# Altium schematic sheet Supply 5V.SchDoc: 5V Isolated Supply
size A4; DocumentNumber: 8; SheetNumber: 8; SheetTotal: 9
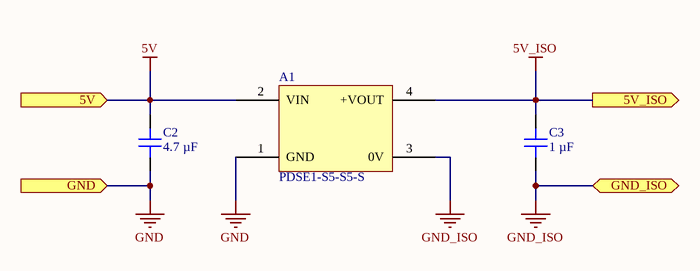
[diagram p0: Supply 5V.SchDoc]

## Parts
A1  PDSE1-S5-S5-S  [CUI PDSE1-S]
C2  4.7 µF  [CAP 0805_2012]
C3  1 µF  [CAP 0805_2012]

## Ports
5V (in, see Review[2C], AC current measurement[1A], Connectors[3A], Opto[1B], SSR_switch[1A], Supply 15V[2B]), 5V_ISO (out, see Review[2C]), GND (in, see Review[2C], AC current measurement[1B], Connectors[3D], Supply 15V[2C]), GND_ISO (bidir, see Review[2C], AC current measurement[1D], Opto[2B], SSR_switch[1B], Supply 15V[3C])

## Nets
5V: A1.2(VIN) C2.2 ; port 5V
5V_ISO: A1.4(+VOUT) C3.2 ; port 5V_ISO
GND: A1.1(GND) C2.1 ; port GND
GND_ISO: A1.3(0V) C3.1 ; port GND_ISO

## Notes on the sheet
- Title
- Size:
- Date:
- A4
- Number:
- Time:
- Revision:
- Sheet
- of
- File:

## Library data of the parts
A1 = PDSE1-S5-S5-S: DC DC CONVERTER 5V 1W; Manufacturer: CUI Inc.; Current - Output (Max): 200mA; Efficiency: 82%; Number of Outputs: 1; Voltage - Input (Max): 5.5V; Voltage - Input (Min): 4.5V; Voltage - Isolation: 3 kV; Part Number: PDSE1-S5-S5-S; Applications: ITE (Commercial); ComponentLink1Description: Datasheet; ComponentLink1URL: https://www.cui.com/product/resource/digikeypdf/pdse1-s.pdf; ComponentLink2Description: DigiKey Link; ComponentLink2URL: https://www.digikey.com/en/products/detail/cui-inc/PDSE1-S5-S5-S/10229826; Features: SCP; LastUpdated: 6/15/2023 9:01:19 PM; Lifecycle Status: Active; Minimum Order: 1; Mounting Type: Through Hole; Operating Temperature: -40°C ~ 105°C (With Derating); Package / Case: 4-SIP Module; Packaging: Tube; PartId: 58; Part Status: Active; Power (Watts): 1 W; Price: 1.62; Series: PDSE1-S (1W); Size / Dimension: 0.46" L x 0.24" W x 0.40" H (11.6mm x 6.0mm x 10.2mm); Supplier 1: DigiKey; Supplier Part Number 1: 102-6291-ND; Type: Isolated Module; Voltage - Output 1: 5V
C2 = CL21B475KAFNNNE: CAP CER 4.7UF 25V X7R 0805; manufacturer: Samsung Electro-Mechanics; Tolerance: ±10%; Part Number: CL21B475KAFNNNE; Value: 4.7 µF; Applications: General Purpose; Capacitance: 4.7 µF; componentlink1description: Datasheet; componentlink1url: http://www.samsungsem.com/kr/support/product-search/mlcc/CL21B475KAFNNNE.jsp; componentlink2description: DigiKey Link; componentlink2url: https://www.digikey.com/en/products/detail/samsung-electro-mechanics/CL21B475KAFNNNE/3888627; Device Package: 0805 (2012 Metric); lastupdated: 5/20/2023 7:17:56 PM; Lifecycle Status: Active; Minimum Order: 1; Mounting Type: Surface Mount, MLCC; Operating Temperature: -55°C ~ 125°C; Package / Case: 0805 (2012 Metric); packaging: TapeAndReel; partid: 3072; Part Status: Active; price: 0.08; series: CL; Size / Dimension: 0.079" L x 0.049" W (2.00mm x 1.25mm); Supplier 1: DigiKey; Supplier Part Number 1: 1276-2969-1-ND; Temperature Coefficient: X7R; Thickness (Max): 0.053" (1.35mm); Voltage - Rated: 25V
C3 = GCJ21BR71H105KA01L: CAP CER 1UF 50V X7R 0805; manufacturer: Murata Electronics; Tolerance: ±10%; Part Number: GCJ21BR71H105KA01L; Value: 1 µF; Applications: Automotive, Boardflex Sensitive; Capacitance: 1 µF; componentlink1description: Datasheet; componentlink1url: https://www.murata.com/~/media/webrenewal/support/library/catalog/products/capacitor/mlcc/c03e.ashx?la=en-us; componentlink2description: DigiKey Link; componentlink2url: https://www.digikey.com/en/products/detail/murata-electronics/GCJ21BR71H105KA01L/4903512; Device Package: 0805 (2012 Metric); Features: Soft Termination; lastupdated: 5/12/2023 7:17:22 PM; Lifecycle Status: Active; Minimum Order: 1; Mounting Type: Surface Mount, MLCC; Operating Temperature: -55°C ~ 125°C; Package / Case: 0805 (2012 Metric); packaging: TapeAndReel; partid: 2709; Part Status: Active; price: 0.05; Ratings: AEC-Q200; series: GCJ; Size / Dimension: 0.079" L x 0.049" W (2.00mm x 1.25mm); Supplier 1: DigiKey; Supplier Part Number 1: 490-10667-1-ND; Temperature Coefficient: X7R; Thickness (Max): 0.057" (1.45mm); Voltage - Rated: 50V